# Altium schematic sheet 0197_LPSS - SMBUS.SchDoc
size A3
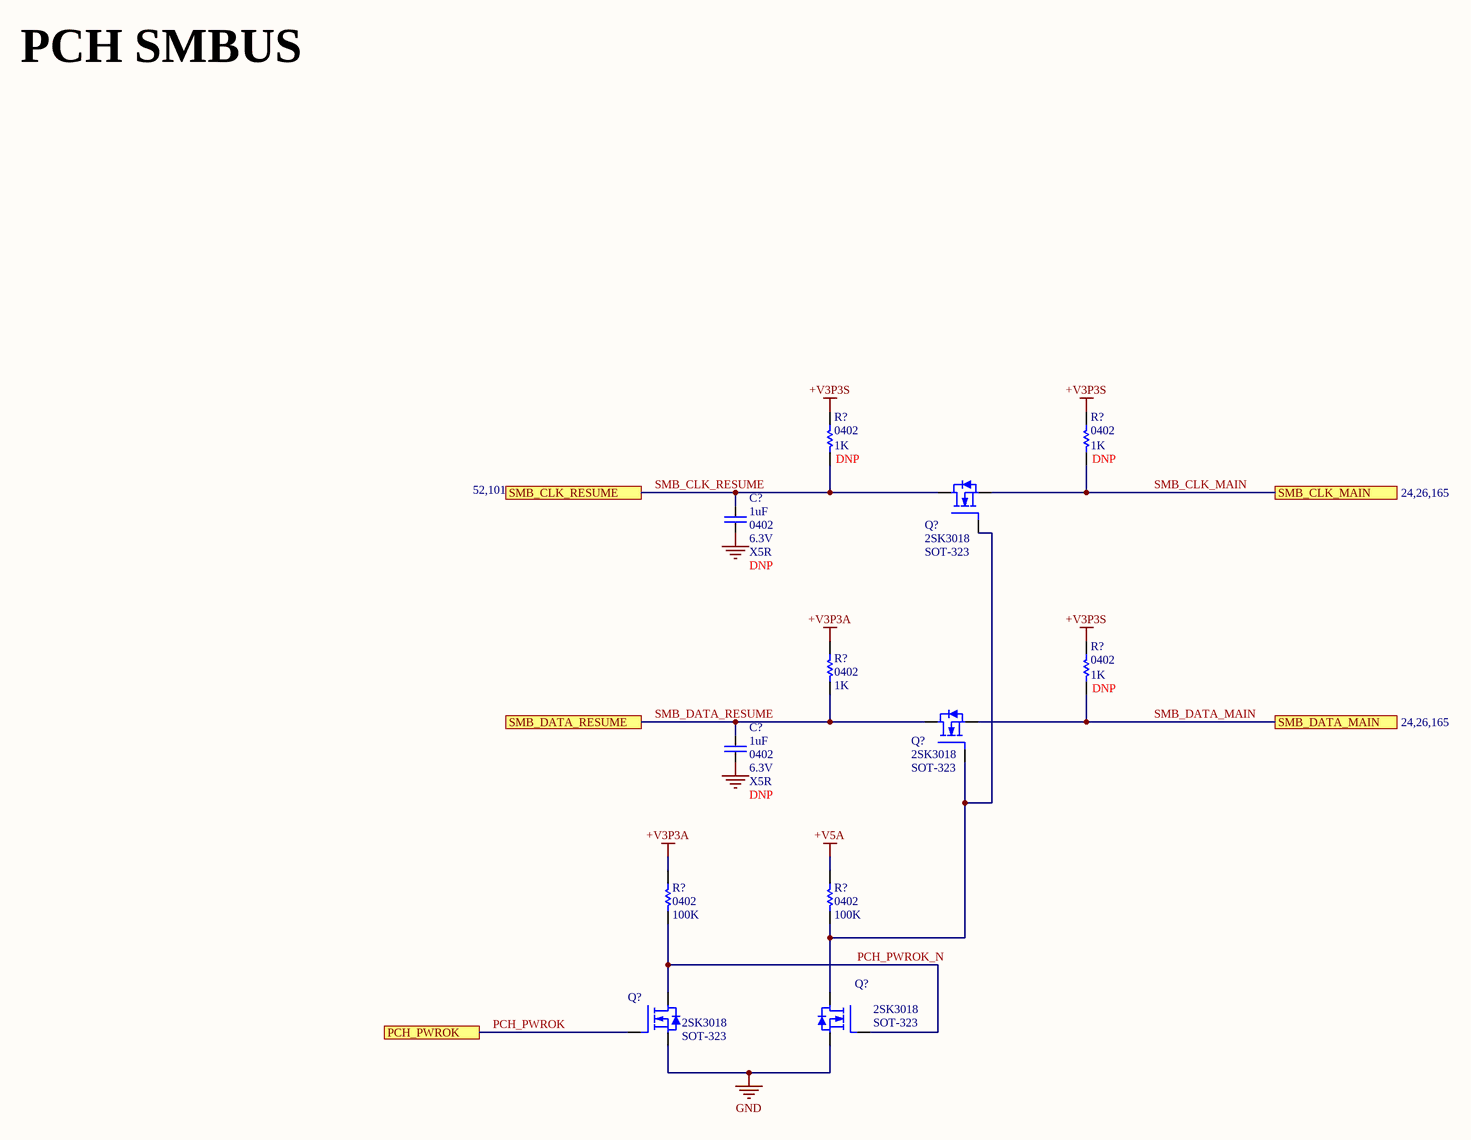
[diagram p0: 0197_LPSS - SMBUS.SchDoc]

## Parts
(Parts that share a designator on the sheet are numbered #1, #2 ... from top to bottom, then left to right.)
C?#1  value 1uF  Case/Package: 0402  Voltage: 6.3V  Dielectric: X5R  [CAPC0402]
C?#2  value 1uF  Case/Package: 0402  Voltage: 6.3V  Dielectric: X5R  [CAPC0402]
Q?#1  Manufacturer Part Number: 2SK3018  Case/Package: SOT-323  [SOT323]  (hidden comment: MOSFET N_2SK3018)
Q?#2  Manufacturer Part Number: 2SK3018  Case/Package: SOT-323  [SOT323]  (hidden comment: MOSFET N_2SK3018)
Q?#3  Manufacturer Part Number: 2SK3018  Case/Package: SOT-323  [SOT323]  (hidden comment: MOSFET N_2SK3018)
Q?#4  Manufacturer Part Number: 2SK3018  Case/Package: SOT-323  [SOT323]  (hidden comment: MOSFET N_2SK3018)
R?#1  value 1K  Case/Package: 0402  [RESC0402]  (hidden comment: Res)
R?#2  value 1K  Case/Package: 0402  [RESC0402]  (hidden comment: Res)
R?#3  value 1K  Case/Package: 0402  [RESC0402]  (hidden comment: Res)
R?#4  value 1K  Case/Package: 0402  [RESC0402]  (hidden comment: Res)
R?#5  value 100K  Case/Package: 0402  [RESC0402]  (hidden comment: Res)
R?#6  value 100K  Case/Package: 0402  [RESC0402]  (hidden comment: Res)

## Ports
PCH_PWROK, SMB_CLK_MAIN, SMB_CLK_RESUME, SMB_DATA_MAIN, SMB_DATA_RESUME

## Nets
+V3P3A: R?#3.1 R?#5.1
+V3P3S: R?#1.1 R?#2.1 R?#4.1
+V5A: R?#6.1
GND: C?#1.1 C?#2.1 Q?#3.2(SOURCE) Q?#4.2(SOURCE)
PCH_PWROK: Q?#3.1(GATE) ; port PCH_PWROK
PCH_PWROK_N: Q?#3.3(DRAIN) Q?#4.1(GATE) R?#5.2
SMB_CLK_MAIN: Q?#1.2(SOURCE) R?#2.2 ; port SMB_CLK_MAIN
SMB_CLK_RESUME: C?#1.2 Q?#1.3(DRAIN) R?#1.2 ; port SMB_CLK_RESUME
SMB_DATA_MAIN: Q?#2.2(SOURCE) R?#4.2 ; port SMB_DATA_MAIN
SMB_DATA_RESUME: C?#2.2 Q?#2.3(DRAIN) R?#3.2 ; port SMB_DATA_RESUME
NetQ?#1_1: Q?#1.1(GATE) Q?#2.1(GATE) Q?#4.3(DRAIN) R?#6.2

## Notes on the sheet
- PCH SMBUS

## Library data of the parts
C?#1 C?#2 = Cap: CAP CER 1uF 6.3V X5R 0402; DNP: DNP
Q?#1-Q?#4 = MOSFET N_2SK3018: NMOS,2SK3018,SOT_323,Id=0.1A,Vds=30V
R?#1-R?#4 = Res: Thick Film Resistor -  1Kohm, 1%, 0402
  R?#1 R?#2 R?#4: DNP: DNP
R?#5 R?#6 = Res: Thick Film Resistor -  100Kohm, 1%, 0402